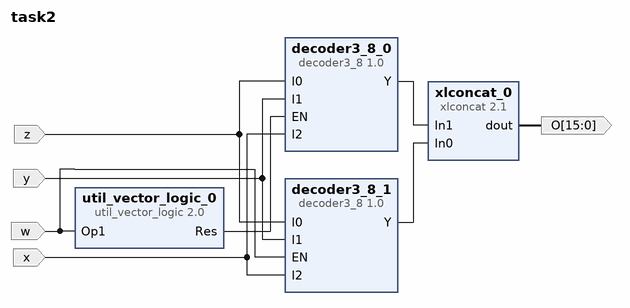
[diagram p0: block diagram of the top level]
# Vivado block design task2, xc7a100tfgg484-1, Vivado 2017.4
create_bd_design task2

create_bd_port -dir I w
create_bd_port -dir I z
create_bd_port -dir I y
create_bd_port -dir I x
create_bd_port -dir O -from 15 -to 0 O

create_bd_cell -type ip -vlnv xilinx.com:user:decoder3_8:1.0 decoder3_8_0
create_bd_cell -type ip -vlnv xilinx.com:user:decoder3_8:1.0 decoder3_8_1
create_bd_cell -type ip -vlnv xilinx.com:ip:xlconcat:2.1 xlconcat_0
set_property -dict {CONFIG.IN0_WIDTH 8 CONFIG.IN1_WIDTH 8} [get_bd_cells xlconcat_0]
create_bd_cell -type ip -vlnv xilinx.com:ip:util_vector_logic:2.0 util_vector_logic_0
set_property -dict {CONFIG.C_SIZE 1 CONFIG.C_OPERATION not} [get_bd_cells util_vector_logic_0]

# ---- connections ----

connect_bd_net [get_bd_ports z] [get_bd_pins decoder3_8_1/I0] [get_bd_pins decoder3_8_0/I0]
connect_bd_net [get_bd_ports y] [get_bd_pins decoder3_8_1/I1] [get_bd_pins decoder3_8_0/I1]
connect_bd_net [get_bd_ports x] [get_bd_pins decoder3_8_1/I2] [get_bd_pins decoder3_8_0/I2]
connect_bd_net [get_bd_pins decoder3_8_1/Y] [get_bd_pins xlconcat_0/In0]
connect_bd_net [get_bd_pins decoder3_8_0/Y] [get_bd_pins xlconcat_0/In1]
connect_bd_net [get_bd_pins xlconcat_0/dout] [get_bd_ports O]
connect_bd_net [get_bd_ports w] [get_bd_pins decoder3_8_1/EN] [get_bd_pins util_vector_logic_0/Op1]
connect_bd_net [get_bd_pins util_vector_logic_0/Res] [get_bd_pins decoder3_8_0/EN]

validate_bd_design
save_bd_design
